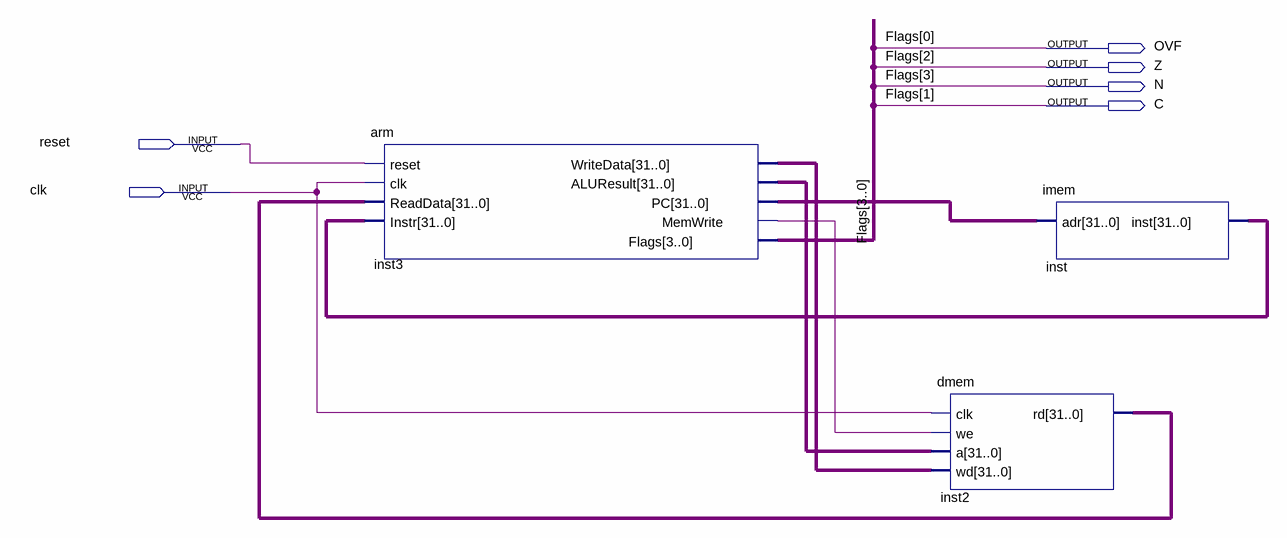
[diagram p0: schematic sheet]
// Quartus schematic toplevel.bdf as structural Verilog: 3 symbols, 6 pins
module toplevel (
  input  reset,
  input  clk,
  output OVF,
  output Z,
  output N,
  output C
);

  wire inst3_memwrite;
  wire [31:0] inst2_rd, inst3_aluresult, inst3_pc, inst3_writedata, inst_inst;

  arm inst3 (
    .reset(reset), .clk(clk), .ReadData(inst2_rd), .Instr(inst_inst), .WriteData(inst3_writedata),
    .ALUResult(inst3_aluresult), .PC(inst3_pc), .MemWrite(inst3_memwrite), .Flags({N, Z, C, OVF}));
  dmem inst2 (.clk(clk), .we(inst3_memwrite), .a(inst3_aluresult), .wd(inst3_writedata), .rd(inst2_rd));
  imem inst (.adr(inst3_pc), .inst(inst_inst));

  // Other names for the same wires on the sheet: Flags[3:0] = {N, Z, C, OVF}
endmodule
